# Altium schematic sheet MODBUS_TO_UART.SchDoc: Modbus to uart
size B; DrawnBy: Kwinten Schram; SheetNumber: 3; SheetTotal: 3
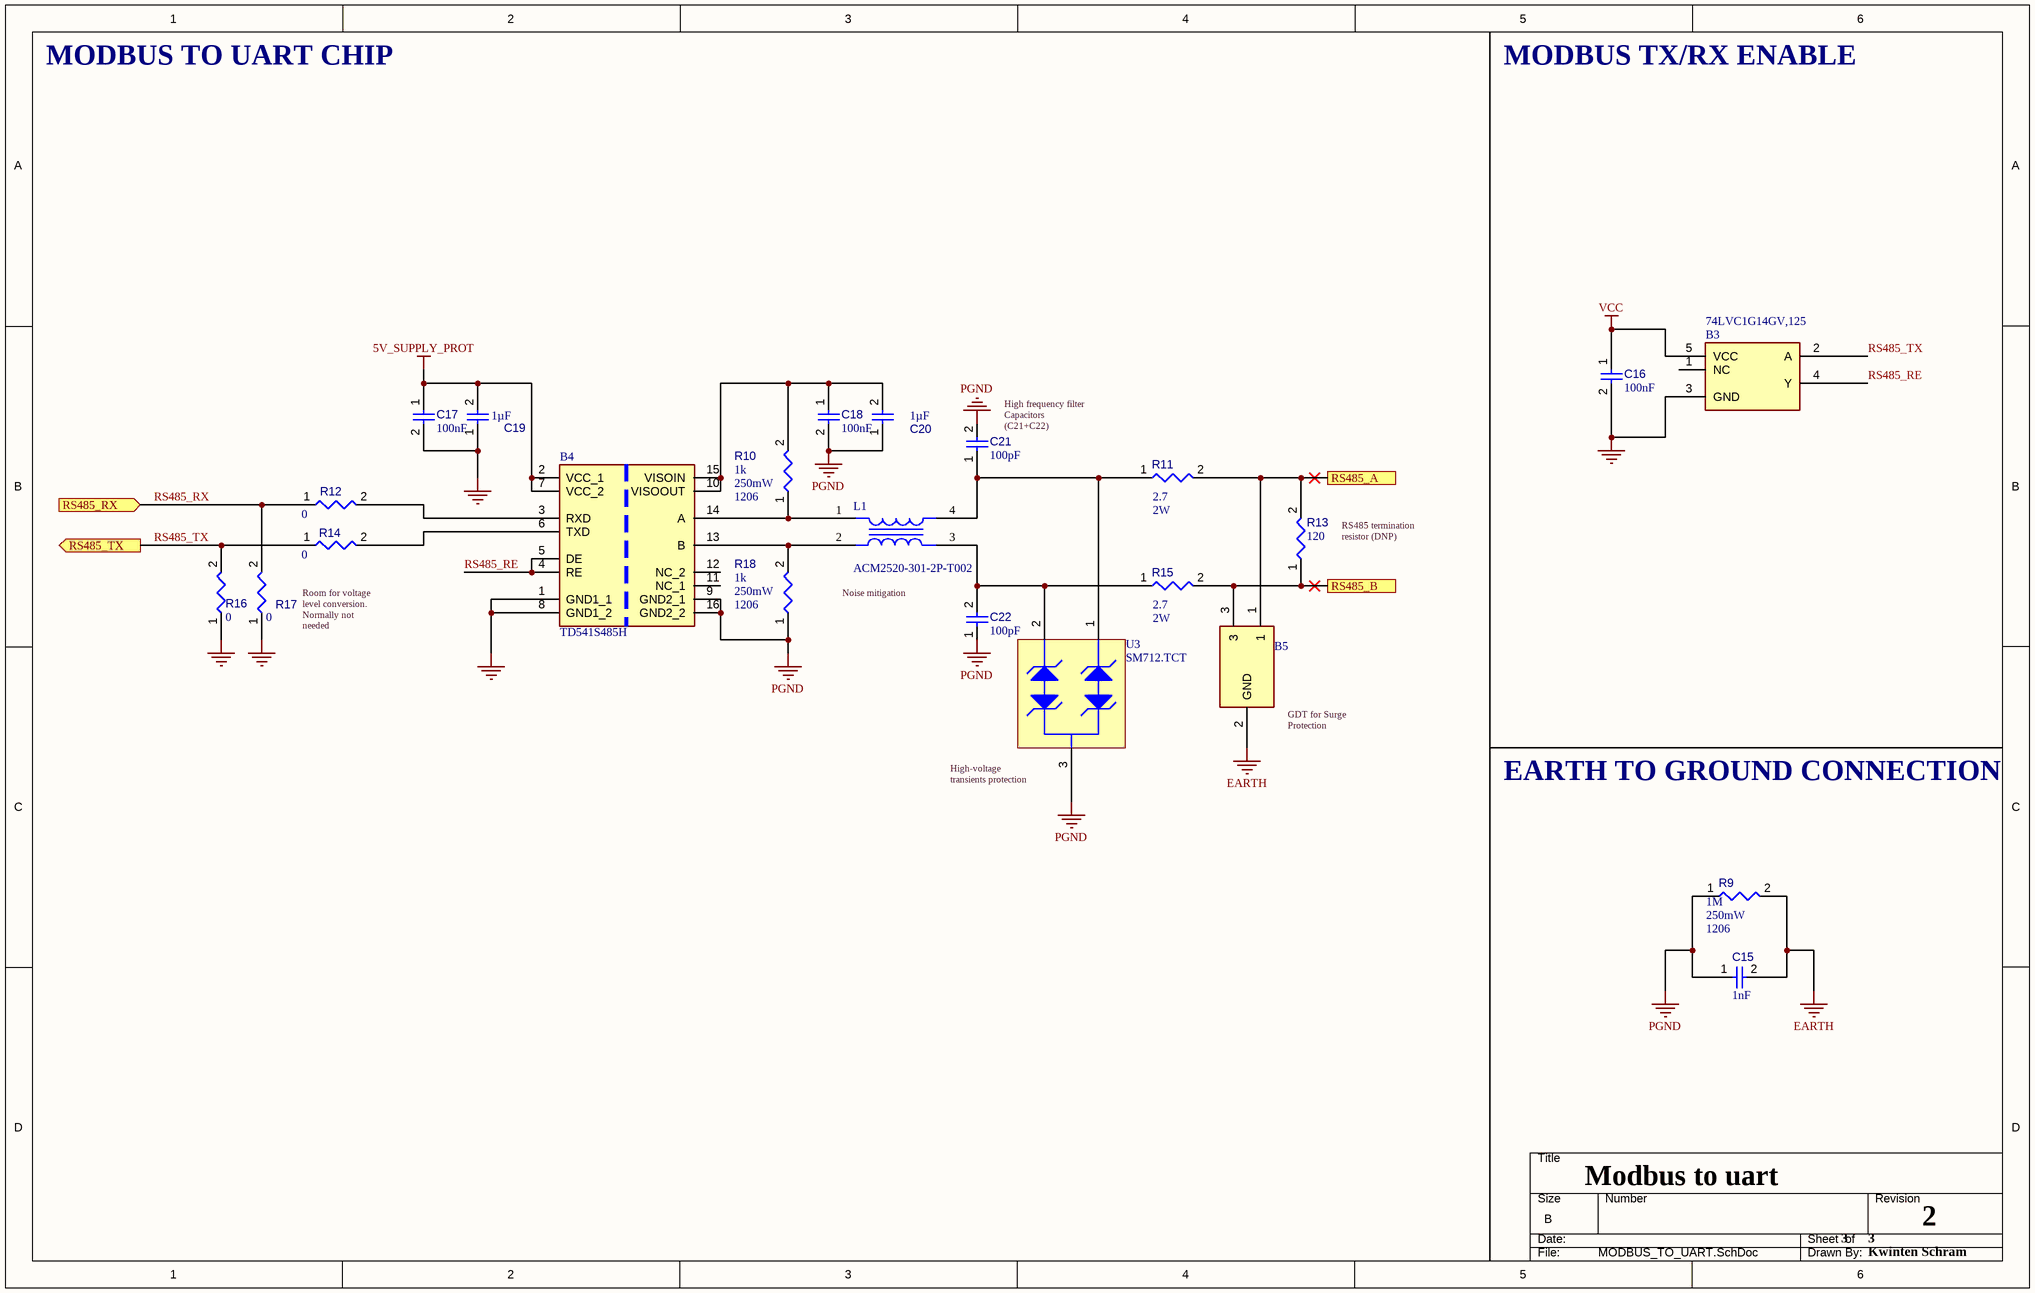
[diagram p0: MODBUS_TO_UART.SchDoc]

## Parts
B3  74LVC1G14GV,125  [74LVC1G14GV,125-Footprint-1]
B4  TD541S485H  [TD541S485H-Footprint-1]
B5  3RL090M-5-S  [2036-09-SM-RPLF-H-Footprint-1]  (value not drawn)
C15  value 1nF  [FP-CC1206-0_3-1_45-IPC_A]  (hidden comment: CC1206KKX7RDBB102)
C16  value 100nF  [FP-0603-L_1_6_0_15-W_0_81-MFG]  (hidden comment: 06033C104KAT2A)
C17  value 100nF  [FP-0603-L_1_6_0_15-W_0_81-MFG]  (hidden comment: 06033C104KAT2A)
C18  value 100nF  [FP-0603-L_1_6_0_15-W_0_81-MFG]  (hidden comment: 06033C104KAT2A)
C19  value 1µF  [FP-CC0603-DA-MFG]  (hidden comment: CC0603KPX7R8BB105)
C20  value 1µF  [FP-CC0603-DA-MFG]  (hidden comment: CC0603KPX7R8BB105)
C21  value 100pF  [FP-CC0603-DA-IPC_B]  (hidden comment: CC0603KRX7R9BB101)
C22  value 100pF  [FP-CC0603-DA-IPC_B]  (hidden comment: CC0603KRX7R9BB101)
L1  ACM2520-301-2P-T002  [FP-ACM2520-2P-MFG]
R9  value 1M  Power: 250mW  Case/Package: 1206  [RESC3116X65X40ML10T20]  (hidden comment: RT1206FRE071ML)
R10  value 1k  Case/Package: 1206  Power: 250mW  [FP-CRCW1206-e3-IPC_A]  (hidden comment: CRCW12061K00JNEC)
R11  value 2.7  Power: 2W  [SMW22R7JT-Footprint-1]  (hidden comment: SMW22R7JT)
R12  value 0  [FP-CRCW0402-e3-IPC_A]  (hidden comment: CRCW04020000Z0ED)
R13  value 120  [FP-RT0603-IPC_C]  (hidden comment: RT0603DRE07120RL)
R14  value 0  [FP-CRCW0402-e3-IPC_A]  (hidden comment: CRCW04020000Z0ED)
R15  value 2.7  Power: 2W  [SMW22R7JT-Footprint-1]  (hidden comment: SMW22R7JT)
R16  value 0  [FP-CRCW0402-e3-IPC_A]  (hidden comment: CRCW04020000Z0ED)
R17  value 0  [FP-CRCW0402-e3-IPC_A]  (hidden comment: CRCW04020000Z0ED)
R18  value 1k  Case/Package: 1206  Power: 250mW  [FP-CRCW1206-e3-IPC_A]  (hidden comment: CRCW12061K00JNEC)
U3  SM712.TCT  [SMTC-SOT23-3_V]

## Ports
RS485_A, RS485_B, RS485_RX (in), RS485_TX (out)

## Nets
5V_SUPPLY_PROT: B4.2(VCC_1) B4.7(VCC_2) C17.1 C19.2
EARTH: B5.2(GND) C15.2 R9.2
GND: B3.3(GND) B4.1(GND1_1) B4.8(GND1_2) C16.2 C17.2 C19.1 R16.1 R17.1
PGND: B4.9(GND2_1) B4.16(GND2_2) C15.1 C18.2 C20.1 C21.2 C22.1 R9.1 R18.1 U3.3
VCC: B3.5(VCC) C16.1
RS485_A: B5.1 R11.2 R13.2 ; port RS485_A
RS485_B: B5.3 R13.1 R15.2 ; port RS485_B
RS485_RE: B3.4(Y) B4.4(RE) B4.5(DE)
RS485_RX: R12.1 R17.2 ; port RS485_RX
RS485_TX: B3.2(A) R14.1 R16.2 ; port RS485_TX
NetB4_3: B4.3(RXD) R12.2
NetB4_6: B4.6(TXD) R14.2
NetB4_10: B4.10(VISOOUT) B4.15(VISOIN) C18.1 C20.2 R10.2
NetB4_13: B4.13(B) L1.2 R18.2
NetB4_14: B4.14(A) L1.1 R10.1
NetC21_1: C21.1 L1.4 R11.1 U3.1
NetC22_2: C22.2 L1.3 R15.1 U3.2

Not connected (* = marked no-connect by the designer): B3 1(NC); B4 11(NC_1) 12(NC_2)

## Notes on the sheet
- MODBUS TO UART CHIP
- MODBUS TX/RX ENABLE
- (near C21) High frequency filter Capacitors (C21+C22)
- (near R13) RS485 termination resistor (DNP)
- Noise mitigation
- Room for voltage level conversion. Normally not needed
- (near B5) GDT for Surge Protection
- (near U3) High-voltage transients protection
- EARTH TO GROUND CONNECTION
- 2
- DWG. NO.
- REV.
- SHT.
- THIS DOCUMENT AND THE DATA DISCLOSED HEREIN OR HEREWITH IS THE PROPERTY OF ALTIUM LIMITED AND MAY BE FREELY DISTRIBUTED IN WHOLE. NO RIGHTS ARE RESERVED OR EXPRESS OR IMPLIED WARANTEE GIVEN.
- REVISION
- DESCRIPTION
- DATE
- APPROVED
- ENG:
- APPROVALS
- PROJECT
- DSN:
- CHK:
- REFERENCE DOCUMENTS
- PROJECT REVISION:
- TITLE
- DOCUMENT REVISION:
- DESIGN ITEM:
- BOM:
- FAB DWG:
- PCB DWG:
- ASSY DWG:
- SCALE:
- SIZE
- B
- CAGE CODE
- FILE NAME
- DWG NO.
- SHEET
- OF
- REV

## Library data of the parts
B3 = CMP-016-00000-2: Inverter, LVC/LCX/Z Series, 1-Func, 1-Input, CMOS, PDSO5; Nominal Supply Voltage: 1.8V; Number of Inputs: 1; Propagation Delay (tpd): 14ns; Max Supply Voltage: 5.5V; Package Body Material: Plastic; Time @ Peak Reflow Temperature-Max (s): 30s; Min Supply Voltage: 1.65V; Case/Package: TSOP; RoHS Compliant: Yes; JESD-609 Code: e3; Channels: 1; Length: 2.9mm; Package Style: SMALL OUTLINE, THIN PROFILEMeter; Terminal Pitch: 0.95mm; Terminal Form: Gull Wing; Pins: 5; Height - Seated (Max): 1.1mm; JESD-30 Code: R-PDSO-G5; Logic Type: INVERTER; Moisture Sensitivity Level: 1; Max Operating Temperature: 125°C; Technology: CMOS; Terminal Position: DUAL; Surface Mount: Yes; Terminal Finish: Tin; Package Shape: Rectangular; Temperature Grade: AUTOMOTIVE; Width: 1.5mm; Min Operating Temperature: -40°C; Peak Reflow Temperature (Cel): 260°C; Reach SVHC Compliant: Yes
B4 = CMP-015-00001-2: Support Circuit; RoHS Compliant: Yes
B5 = CMP-005-00007-1: 3R-5-S Series 5 mm 600 V 5 kA Surface Mount Gas Discharge Tube; Current Rating: 5kA
C15 = CMP-001-00035-1: Ceramic Capacitor, Multilayer, Ceramic, 2000V, 10% +Tol, 10% -Tol, X7R, 15% TC, 0.001uF, Surface Mount, 1206; Rated DC Voltage (URdc): 2kV; Multilayer: Yes; Temperature Characteristics Code: X7R; RoHS Compliant: Yes; Tolerance (fill in as +-): 10%; Min Operating Temperature: -55°C; Packaging: Tape and Reel; Reach SVHC Compliant: Yes; Tolerance: 10%; Termination: Wraparound; Tolerance  (fill in as +-): 10%; Max Operating Temperature: 125°C; Package Shape: Rectangular; Width: 1.6mm; Length: 3.2mm; Case/Package: 1206; JESD-609 Code: e3; Pins: 2; Terminal Finish: Nickel; Capacitor Type: Ceramic; Height: 1.25mm; Mounting Technology: Surface Mount; Package Style: SMTMeter; Dielectric Material: Ceramic
C16-C18 = CMP-001-00020-3: Ceramic Capacitor, Multilayer, Ceramic, 25V, 10% +Tol, 10% -Tol, X7R, 15% TC, 0.1uF, Surface Mount, 0603; Multilayer: Yes; Height: 0.9mm; Tolerance: 10%; Reach SVHC Compliant: Yes; Package Shape: Rectangular; Max Operating Temperature: 125°C; Rated DC Voltage (URdc): 25V; Min Operating Temperature: -55°C; Dielectric Material: Ceramic; Capacitor Type: Ceramic; Case/Package: 0603; Pins: 2; JESD-609 Code: e3; Package Style: SMTMeter; Termination: Wraparound; RoHS Compliant: Yes; Length: 1.6mm; Temperature Characteristics Code: X7R; Tolerance (fill in as +-): 10%; Tolerance  (fill in as +-): 10%; Packaging: Tape and Reel; Mounting Technology: Surface Mount; Width: 0.81mm; Terminal Finish: Nickel
C19 C20 = CMP-001-00009-4: Ceramic Capacitor, Multilayer, Ceramic, 25V, 10% +Tol, 10% -Tol, X7R, 15% TC, 1uF, Surface Mount, 0603; Multilayer: Yes; Dielectric Material: Ceramic; Min Operating Temperature: -55°C; Pins: 2; Case/Package: 0603; Capacitance: 1uF; Packaging: Tape and Reel; REACH SVHC: Yes; Rated DC Voltage (URdc): 25V; Width: 0.8mm; RoHS Compliant: Yes; Voltage Rating: 25V; Tolerance: 10%; Size Code: 0603; Terminal Finish: Nickel; Max Operating Temperature: 125°C; JESD-609 Code: e3; Negative Tolerance: 10%; Temperature Characteristics Code: X7R; Package Style: SMTMeter; Length: 1.6mm; Number of Pins: 2; Capacitor Type: Ceramic; Positive Tolerance: 10%; Height: 0.8mm
C21 C22 = CMP-001-00037-1: Ceramic Capacitor, Multilayer, Ceramic, 50V, 10% +Tol, 10% -Tol, X7R, 15% TC, 0.0001uF, Surface Mount, 0603; Multilayer: Yes; Tolerance: 10%; Mounting Technology: Surface Mount; Reach SVHC Compliant: Yes; Package Style: SMTMeter; Termination: Wraparound; JESD-609 Code: e3; Package Shape: Rectangular; RoHS Compliant: Yes; Length: 1.6mm; Case/Package: 0603; Dielectric Material: Ceramic; Height: 0.8mm; Max Operating Temperature: 125°C; Packaging: Tape and Reel; Width: 0.8mm; Min Operating Temperature: -55°C; Terminal Finish: Nickel; Tolerance (fill in as +-): 10%; Tolerance  (fill in as +-): 10%; Temperature Characteristics Code: X7R; Rated DC Voltage (URdc): 50V; Capacitor Type: Ceramic; Pins: 2
L1 = CMP-012-00000-3: Ferrite Chip, 2 Function(s), 20V, 0.4A, 4 Pin(s); Channels: 2; Current Rating: 400mA; Output Impedance: 300R; DC Resistance-Max: 350mR; Insulation Resistance-Min: 10MR; Voltage Rating: 20V; Packaging: Tape and Reel; Height: 1.2mm; Filter Type: FERRITE CHIP; Mounting Technology: Surface Mount; RoHS Compliant: Yes; Width: 2mm; Length: 2.5mm; Reach SVHC Compliant: Yes
R9 = CMP-009-00089-1: Fixed Resistor, Thin Film, 0.25W, 1000000ohm, 200V, 1% +/-Tol, 50ppm/Cel, Surface Mount, 1206; Additional Feature: HIGH PRECISION; Package Height: 0.55mm; Package Length: 3.1mm; Package Width: 1.6mm; Rated Temperature: 70°C; Temperature Coefficient: 50ppm/°C; Reach SVHC Compliant: Yes; Mounting Technology: Surface Mount; RoHS Compliant: Yes; Pins: 2; Resistor Type: FIXED RESISTOR; Tolerance: 1%; Min Operating Temperature: -55°C; Working Voltage: 200V; Technology: THIN FILM; Packaging: Tape and Reel; Max Operating Temperature: 155°C; Construction: Chip; Termination: Wraparound; Package Style: SMTMeter
R10 R18 = CMP-009-00085-1: Fixed Resistor, Metal Glaze/thick Film, 0.25W, 1000ohm, 200V, 5% +/-Tol, 200ppm/Cel, Surface Mount, 1206; Reference Standard: AEC-Q200; Package Height: 0.55mm; Additional Feature: RATED AC VOLTAGE (V): 200; Package Length: 3.2mm; Package Width: 1.6mm; Temperature Coefficient: 200ppm/°C; Rated Temperature: 70°C; Pins: 2; Working Voltage: 200V; Terminal Finish: Nickel; Max Operating Temperature: 155°C; Reach SVHC Compliant: Yes; RoHS Compliant: Yes; Construction: Chip; Package Style: SMTMeter; Tolerance: 5%; Min Operating Temperature: -55°C; Termination: Wraparound; Mounting Technology: Surface Mount; Resistor Type: FIXED RESISTOR; Packaging: Tape and Reel; Technology: METAL GLAZE/THICK FILM; Package Shape: Rectangular; JESD-609 Code: e3
R11 R15 = CMP-009-00082-1: Fixed Resistor, Wire Wound, 2W, 2.7ohm, 300V, 5% +/-Tol, 200ppm/Cel, Surface Mount, 2616; Temperature Coefficient: 200ppm/°C; Package Length: 6.7mm; Package Width: 4mm; Package Height: 3.55mm; Rated Temperature: 25°C; Termination: Wraparound; RoHS Compliant: Yes; JESD-609 Code: e3; Pins: 2; Technology: WIRE WOUND; Package Style: SMTMeter; Tolerance: 5%; Packaging: Tape and Reel; Working Voltage: 300V; Construction: Rectangular; Terminal Finish: Tin; Case/Package: 2616; Package Shape: Rectangular; Reach SVHC Compliant: Yes; Max Operating Temperature: 280°C; Resistor Type: FIXED RESISTOR; Mounting Technology: Surface Mount
R12 R14 R16 R17 = CMP-009-00087-1: Metal Glaze/thick Film, 0.063W, 0ohm, Surface Mount, 0402; Power: 63mW; Package Length: 1mm; Package Width: 0.5mm; Reference Standard: AEC-Q200; Rated Temperature: 70°C; Package Height: 0.35mm; Min Operating Temperature: -55°C; Max Operating Temperature: 155°C; Pins: 2; Case/Package: 0402; RoHS Compliant: Yes; Mounting Technology: Surface Mount; Termination: Wraparound; Terminal Finish: Nickel; Reach SVHC Compliant: Yes; Technology: METAL GLAZE/THICK FILM; Package Shape: Rectangular; JESD-609 Code: e3; Package Style: SMTMeter; Construction: Chip; Packaging: Tape and Reel; Resistor Type: FIXED RESISTOR
R13 = CMP-009-00083-1: Fixed Resistor, Thin Film, 0.1W, 120ohm, 75V, 0.5% +/-Tol, 50ppm/Cel, Surface Mount, 0603; Rated Temperature: 70°C; Package Height: 0.45mm; Package Length: 1.6mm; Package Width: 0.8mm; Power: 100mW; Temperature Coefficient: 50ppm/°C; Mounting Technology: Surface Mount; Construction: Chip; Working Voltage: 75V; Tolerance: 0.5%; Reach SVHC Compliant: Yes; Technology: THIN FILM; Max Operating Temperature: 155°C; Pins: 2; Package Style: SMTMeter; Termination: Wraparound; Case/Package: 0603; Packaging: Tape and Reel; Min Operating Temperature: -55°C; RoHS Compliant: Yes; Resistor Type: FIXED RESISTOR
U3 = CMP-004-00016-1: Trans Voltage Suppressor Diode, 400W, 12V V(RWM), Unidirectional, 4 Element, Silicon; Breakdown Voltage-Nom: 7.5V; Forward Voltage: 0V; Number of Elements: 4; Qualification Status: Not Qualified; Clamping Voltage-Max: 26V; Package Body Material: Plastic; Time @ Peak Reflow Temperature-Max (s): 30s; Polarity: Unidirectional; Pins: 3; Rep Pk Reverse Voltage-Max: 12V; Terminal Position: DUAL; Package Shape: Rectangular; Max Operating Temperature: 125°C; JESD-30 Code: R-PDSO-G3; Non-rep Peak Rev Power Dis-Max: 400W; Min Operating Temperature: -55°C; Diode Element Material: SILICON; JESD-609 Code: e3; Reach SVHC Compliant: Yes; RoHS Compliant: Yes; Diode Type: TRANS VOLTAGE SUPPRESSOR; Technology: AVALANCHE; Terminal Finish: Tin; Min Breakdown Voltage: 7.5V; Peak Reflow Temperature (Cel): 260°C; Package Style: SMALL OUTLINEMeter; Moisture Sensitivity Level: 1; Terminal Form: Gull Wing; Surface Mount: Yes